# Altium schematic sheet BoardA-Connectors.SchDoc
size A; SheetNumber: 2; SheetTotal: 9
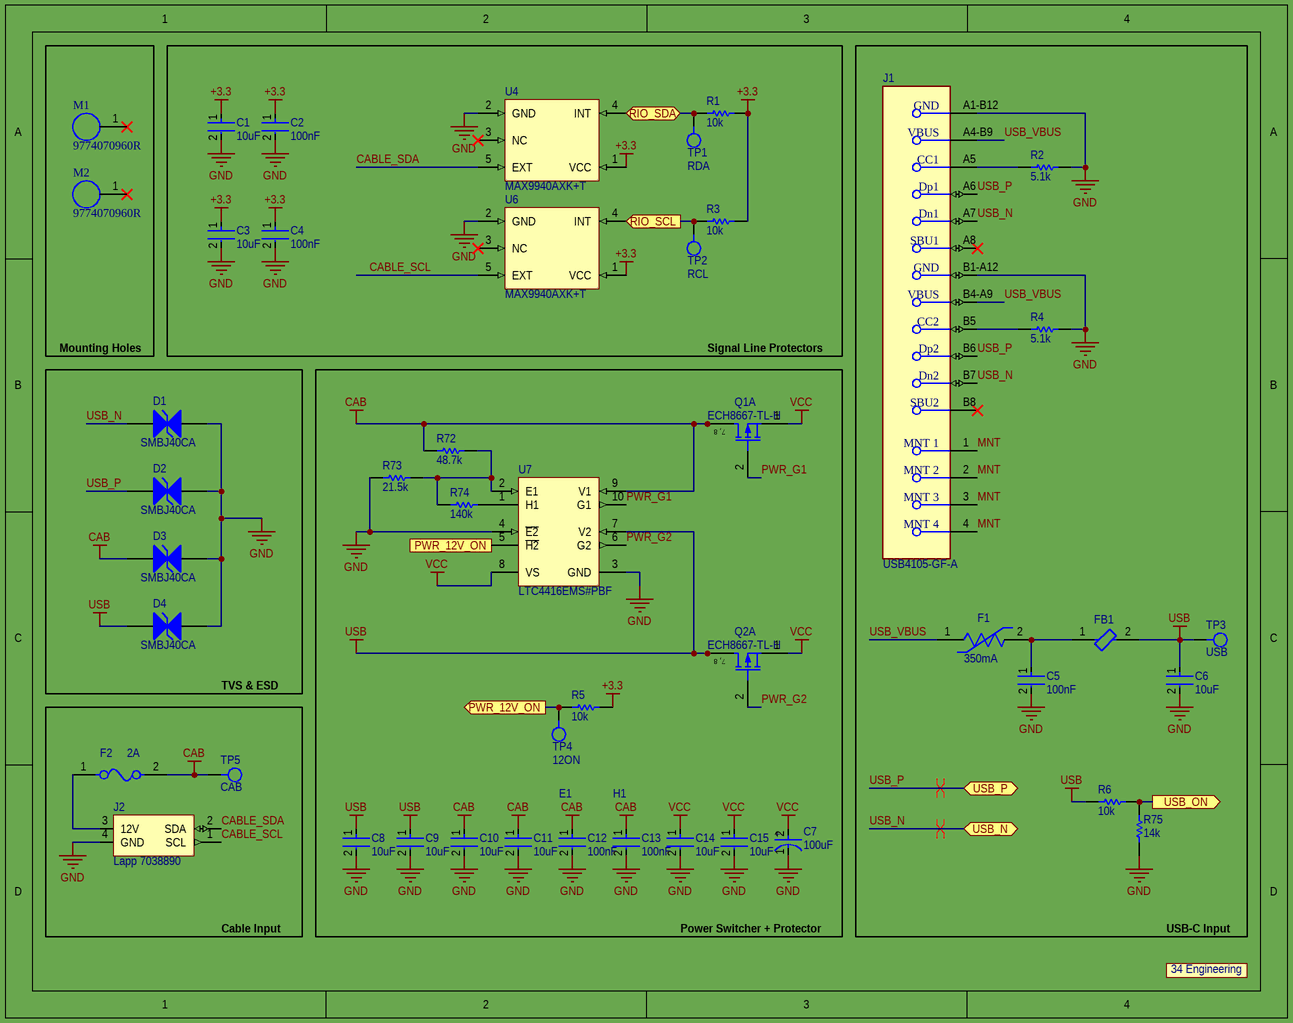
[diagram p0: BoardA-Connectors.SchDoc]

## Parts
C1  10uF  [FP-GRM188-0_1-e0_2_0_55-IPC_A]
C2  100nF  [FP-CGA3E-0_3-0_1-IPC_A]
C3  10uF  [FP-GRM188-0_1-e0_2_0_55-IPC_A]
C4  100nF  [FP-CGA3E-0_3-0_1-IPC_A]
C5  100nF  [FP-CGA3E-0_3-0_1-IPC_A]
C6  10uF  [FP-C3225-250-0_4-MFG]
C7  100uF  [FP-T491X107K025AT-MFG]
C8  10uF  [FP-C3225-250-0_4-MFG]
C9  10uF  [FP-C3225-250-0_4-MFG]
C10  10uF  [FP-C3225-250-0_4-MFG]
C11  10uF  [FP-C3225-250-0_4-MFG]
C12  100nF  [FP-CGA3E-0_3-0_1-IPC_A]
C13  100nF  [FP-CGA3E-0_3-0_1-IPC_A]
C14  10uF  [FP-C3225-250-0_4-MFG]
C15  10uF  [FP-C3225-250-0_4-MFG]
D1  SMBJ40CA  [FAIR-DO-214AA-A-2_V]
D2  SMBJ40CA  [FAIR-DO-214AA-A-2_V]
D3  SMBJ40CA  [FAIR-DO-214AA-A-2_V]
D4  SMBJ40CA  [FAIR-DO-214AA-A-2_V]
F1  350mA  [FP-1812L035-30DR-MFG]
F2  2A  [FP-2920L-MFG]
FB1  BLM15AG100SN1D  [FP-BLM15-0_05-IPC_A]  (value not drawn)
J1  USB4105-GF-A  [FP-USB4105-GF-A-MFG]
J2  Lapp 7038890  [Lapp 7038890]
LOGO0  34 Engineering Logo  [34EngineeringLogo]  (value not drawn)
M1  9774070960R  [9774070960R]
M2  9774070960R  [9774070960R]
Q1  ECH8667-TL-H  [ONSC-ECH-8_V]  (part A of 2)
Q2  ECH8667-TL-H  [ONSC-ECH-8_V]  (part A of 2)
R1  10k  [RESC1609X55X30LL15T15]
R2  5.1k  [RESC1608X55X30ML20T20]
R3  10k  [RESC1609X55X30LL15T15]
R4  5.1k  [RESC1608X55X30ML20T20]
R5  10k  [RESC1609X55X30LL15T15]
R6  10k  [RESC1609X55X30LL15T15]
R72  48.7k  [RESC1608X55X30ML15T15]
R73  21.5k  [RESC1608X55X30ML15T15]
R74  140k  [RESC1608X55X30LL15T15]
R75  14k  [RESC1608X55X30ML15T15]
TP1  RDA  [TestPoint1mm]
TP2  RCL  [TestPoint1mm]
TP3  USB  [TestPoint1mm]
TP4  12ON  [TestPoint1mm]
TP5  CAB  [TestPoint1mm]
U4  MAX9940AXK+T  [MAX9940AXK+T]
U6  MAX9940AXK+T  [MAX9940AXK+T]
U7  LTC4416EMS#PBF  [LT-MS-10_N]

## Blocks framed on the sheet
Mounting Holes: M1 M2
Signal Line Protectors: C1-C4 R1 R3 TP1 TP2 U4 U6
USB-C Input: C5 C6 F1 FB1 J1 R2 R4 R6 R75 TP3
TVS & ESD: D1-D4

## Ports
PWR_12V_ON (out), RIO_SCL (out), RIO_SDA (bidir), USB_N (bidir), USB_ON (out), USB_P (bidir)

## Nets
+3.3: C1.1 C2.1 C3.1 C4.1 R1.2 R3.2 R5.2 U4.1(VCC) U6.1(VCC)
CAB: C10.1 C11.1 C12.1 C13.1 D3.2(A) F2.2 Q1.7(D1) Q1.8(D1) R72.1 TP5.1 U7.9(V1)
GND: C1.2 C2.2 C3.2 C4.2 C5.2 C6.2 C7.1(C) C8.2 C9.2 C10.2 C11.2 C12.2 C13.2 C14.2 C15.2 D1.1(A) D2.1(A) D3.1(A) D4.1(A) J1.A1-B12(GND) J1.B1-A12(GND) J2.4(GND) R2.2 R4.2 R73.1 R75.1 U4.2(GND) U6.2(GND) U7.3(GND) U7.4(~{E2})
USB: C6.1 C8.1 C9.1 D4.2(A) FB1.2 Q2.7(D1) Q2.8(D1) R6.2 TP3.1 U7.7(V2)
VCC: C7.2(A) C14.1 C15.1 Q1.1(S1) Q2.1(S1) U7.8(VS)
CABLE_SCL: J2.1(SCL) U6.5(EXT)
CABLE_SDA: J2.2(SDA) U4.5(EXT)
MNT: J1.1(MNT_1) J1.2(MNT_2) J1.3(MNT_3) J1.4(MNT_4)
PWR_12V_ON: R5.1 TP4.1 U7.5(~{H2}) ; port PWR_12V_ON
PWR_G1: Q1.2(G1) U7.10(G1)
PWR_G2: Q2.2(G1) U7.6(G2)
RIO_SCL: R3.1 TP2.1 U6.4(INT) ; port RIO_SCL
RIO_SDA: R1.1 TP1.1 U4.4(INT) ; port RIO_SDA
USB_N: D1.2(A) J1.A7(Dn1) J1.B7(Dn2) ; port USB_N
USB_ON: R6.1 R75.2 ; port USB_ON
USB_P: D2.2(A) J1.A6(Dp1) J1.B6(Dp2) ; port USB_P
USB_VBUS: F1.1 J1.A4-B9(VBUS) J1.B4-A9(VBUS)
NetC5_1: C5.1 F1.2 FB1.1
NetF2_1: F2.1 J2.3(12V)
NetJ1_A5: J1.A5(CC1) R2.1
NetJ1_B5: J1.B5(CC2) R4.1
NetR72_2: R72.2 R73.2 R74.1 U7.2(E1)
NetR74_2: R74.2 U7.1(H1)

Not connected (* = marked no-connect by the designer): J1 A8(SBU1)* B8(SBU2)*; M1 1*; M2 1*; U4 3(NC)*; U6 3(NC)*

## Layout directives
differential pair; differential pair class USB: USB_N, USB_P

## Notes on the sheet
- E1
- H1
- Cable Input
- Power Switcher + Protector
- (in symbol 34EngineeringLogo) 34 Engineering
- (in symbol CMP-1058-00460-1, part A) 7, 8
- (in symbol CMP-2000-07204-2) +

## Library data of the parts
C1 C3 = CMP-2006-02792-2: Chip Multilayer Ceramic Capacitors for General Purpose, 0603, 10uF, X5R, 15%, 20%, 6.3V; Packaging: Tape and Reel; Voltage Rating (DC): 6.3V; Width: 0.031inch; Termination: SMD/SMT; Dielectric: X5R; Package Quantity: 4000; Voltage Rating: 6.3V; Capacitance: 10uF; Case/Package: 0603; Min Operating Temperature: -55°C; Voltage: 6.3V; Length: 1.6mm; Thickness: 0.035inch; Lead Free: Lead Free; Depth: 0.8mm; Case Code (Imperial): 0603; Max Operating Temperature: 85°C; Material: Ceramic; Height: 0.8mm; Tolerance: 20%; Mount: Surface Mount; REACH SVHC: No SVHC; Radiation Hardening: No; Case Code (Metric): 1608
C2 C4 C5 C12 C13 = CMP-2000-07546-2: Cap Ceramic 100nF 50V X7R 10% Pad SMD 0603 +125°C Automotive T/R; Weight: 7.1E-05oz; Composition: Ceramic; Max Operating Temperature: 125°C; Termination: SMD/SMT; Dielectric: X7R; Length: 1.6mm; Package Quantity: 1; REACH SVHC: No SVHC; Lead Free: Lead Free; Case Code (Metric): 1608; Min Operating Temperature: -55°C; Packaging: Tape and Reel; Tolerance: 10%; Voltage Rating: 50V; Case Code (Imperial): 0603; Capacitance: 100nF; Case/Package: 0603; Voltage Rating (DC): 50V; Depth: 0.8mm; Radiation Hardening: No; Ratings: AEC-Q200; Mount: Surface Mount; Voltage: 50V; Thickness: 0.035inch; Width: 0.8mm; Height: 0.8mm
C6 C8-C11 C14 C15 = CMP-08246-002653-1: Multilayer Ceramic Capacitors 10uF ±20% 50V X7R SMD 1210; Width: 0.098inch; Package Quantity: 1000; Height: 2.5mm; Dielectric Material: Ceramic; Voltage Rating: 50V; Series: C; Capacitance: 10uF; Tolerance: 20%; Weight: 0.000564oz; Case/Package: 1210; Case Code (Imperial): 1210; Dielectric: X7R; Case Code (Metric): 3225; REACH SVHC: No SVHC; Packaging: Tape and Reel; Length: 0.126inch; Termination: SMD/SMT; Min Operating Temperature: -55°C; Voltage Rating (DC): 50V; Lead Free: Lead Free; Max Operating Temperature: 125°C; Thickness: 0.11inch; Mount: Surface Mount
C7 = CMP-2000-07204-2: CAP TANT 100UF 10% 25V 2917; Leakage Current: 25uA; Ripple Current: 742mA; Polarity: Polar; Dissipation Factor: 8%; Life (Hours): 2000Hour; Dielectric Material: Tantalum; ESR (Equivalent Series Resistance): 300mR; Length: 7.3mm; RoHS Compliant: No; Failure Rate: 0.001%; REACH SVHC: No SVHC; Tolerance: 10%; Mount: Surface Mount; Height - Seated (Max): 0.169inch; Features: General Purpose; Height: 4mm; Package Quantity: 1; Case Code (Metric): 7343; Max Operating Temperature: 125°C; Number of Pins: 2; Radiation Hardening: No; Lead Free: Lead Free; Capacitance: 100uF; Termination: SMD/SMT; Voltage Rating: 25V; Series: T491; Depth: 4.3mm; Construction: Flat; Case/Package: 2917; Min Operating Temperature: -55°C; Voltage Rating (DC): 25V; Width: 4.3mm; Packaging: Tape and Reel; Case Code (Imperial): 2917; Voltage: 25V
D1-D4 = CMP-2000-07097-1: Transient Voltage Suppressor, 600 W, 40 V, -55 to 150 degC, 2-Pin SMD, RoHS, Tape and Reel; Manufacturer: Fairchild Semiconductor; Breakdown Voltage-Max: 49.1V; Power Dissipation: 600W; Directional: Bi-Directional; Clamping Voltage-Max: 64.5V; Breakdown Voltage-Min: 44.4V; Datasheet URL: https://www.fairchildsemi.com/datasheets/SM/SMBJ40CA.pdf; Package Description: 2-Pin Surface Mount Device, Body 4.4 x 3.625 mm; Package Reference: DO-214AA; Manufacturer URL: https://www.fairchildsemi.com/; Mounting Technology: SurfaceMount; Datasheet Version: Rev. 1.1.1, 11/2014
F1 = CMP-08606-000005-1: PTC RESET FUSE 30V 350MA 1812; Manufacturer Part Number: 1812L035/30DR; Manufacturer: Littelfuse Inc; Trip Time: 0.15s; Hold Current: 0.35A; Value: 0.4-1.7Ω; Trip Current: 0.75A; Current Rating: 40A; Temperature Range High: +85°C; Ambient Temperature Range High: +85°C; Device Class L2: PTC Resettable Fuses; RoHS: TRUE; Digikey Description: PTC RESET FUSE 30V 350MA 1812; ComponentLink2URL: https://www.littelfuse.com/~/media/electronics/datasheets/resettable_ptcs/littelfuse_ptc_1812l_datasheet.pdf.pdf; Lead Free: Yes; Ambient Temperature Range Low: -40°C; Automotive: No; Category: Fuse; Octopart: https://octopart.com/1812l035%2F30dr-littelfuse-19645438; Device Class L3: unset; Device Class L1: Circuit Protection; Temperature Range Low: -40°C; Mouser Description: Resettable Fuses - PPTC PTC 30V POLY 1812 HALOGEN-FREE .35A; Package: 0; Voltage Rating: 30V; ComponentLink2Description: Datasheet; Temperature: -40°C to +85°C; Resistance: 0.4-1.7Ω; Height: 1.25mm
F2 = CMP-08606-000027-1: PTC RESET FUSE 24V 2A 2920; Manufacturer Part Number: 2920L200/24DR; Manufacturer: Littelfuse Inc; Current Rating: 40A; Resistance: 0.05-0.125Ω; Trip Current: 4A; Value: 0.05-0.125Ω; Trip Time: 5s; Hold Current: 2A; Device Class L2: PTC Resettable Fuses; Package: 2920L; Octopart: https://octopart.com/2920l200%2F24dr-littelfuse-673793; Category: Fuse; Device Class L1: Circuit Protection; Temperature Range High: +85°C; Device Class L3: unset; Mouser Description: Resettable Fuses - PPTC 24V 2920 2A POLYFUSE; Temperature Range Low: -40°C; ComponentLink2URL: https://www.littelfuse.com/~/media/electronics/datasheets/resettable_ptcs/littelfuse_ptc_2920l_datasheet.pdf.pdf; Voltage Rating: 24V; Automotive: No; Ambient Temperature Range Low: -40°C; Height: 1.25mm; Digikey Description: PTC RESET FUSE 24V 2A 2920; Temperature: -40°C to +85°C; Lead Free: Yes; Ambient Temperature Range High: +85°C; RoHS: TRUE; ComponentLink2Description: Datasheet
FB1 = CMP-0686-00176-4: Chip Ferrite Bead, 0402, 10Ω @ 100MHz, 0.025Ω, 25%, 1A; Number of Circuits: 1; DC Resistance (DCR): 25mR; Shielding: Unshielded; Resistance: 50mR; Impedance: 10R; Max Current Rating: 1A; Length: 1mm; Min Operating Temperature: -55°C; Case Code (Imperial): 0402; Current Rating: 1A; Termination: SMD/SMT; Test Frequency: 100MHz; Depth: 0.55mm; Package Quantity: 1; Packaging: Tape and Reel; Height: 0.5mm; Max DC Current: 1A; DC Current: 1A; RoHS Compliant: Yes; Resistor Type: Ferrite Bead; Tolerance: 25%; Number of Lines: 1; Lead Free: Lead Free; Max Operating Temperature: 125°C; Core Material: Ferrite; Case Code (Metric): 1005; REACH SVHC: No SVHC; Width: 0.5mm; Radiation Hardening: No; Number of Pins: 2; Material: Ferrite; Case/Package: 0402; Military Standard: Not; Weight: 2.3E-05oz
J1 = CMP-245163-000001-1: CONN RCPT USB2.0 TYPEC 5A; Manufacturer: GCT; Voltage Rating: 20V; Is Female: yes; Current Rating: 5/6.25/1.25/0.25A; Number Of Contacts: 16; Conn Orientation: Right Angle; Device Class L1: Connectors; Category: Conn; Lead Free: Yes; RoHS: TRUE; Temperature Range High: +85°C; Digikey Description: CONN RCPT USB2.0 TYPEC 5A; Device Class L3: unset; ComponentLink2Description: Datasheet; Manufacturer Part Number: USB4105-GF-A; Package: 0; Usb Standard: USB 2.0; Device Class L2: USB Connectors; Automotive: No; Temperature Range Low: -40°C; Height: 3.46mm; Temperature: -40°C to +85°C; Contact Material: Gold,Nickel; ComponentLink2URL: https://gct.co/files/drawings/usb4105.pdf; Octopart: https://octopart.com/usb4105-gf-a-gct-106627878
LOGO0 = 34EngineeringLogo: 34 Engineering Silkscreen Logo
M1 M2 = 9774070960R: WURTH ELEKTRONIK - 9774070960R - Abstandhalter, SMD, Stahl, rund, Durchgangsloch, 6mm x 7mm, 3.3mm Innen-Ø, Produktreihe WA-SMST; Manufacturer: Wurth Electronics; Plating: Tin; Threaded/Unthreaded: Unthreaded; Inside Diameter: 0.13inch; Outside Diameter: 0.236inch; Supplier 1: Digi-Key; Manufacturer Part Number: 9774070960R; RoHS: Yes; Category: Spacers, Standoffs; Stock 1: 8951; Pricing 1: 1=1.73000, 10=1.65800, 50=1.45600, 100=1.35500 (USD); Material: Steel; Length: 0.33inch; REACH SVHC: Unknown; ComponentLink1URL: http://www.mouser.com/ds/2/445/9774070960R-611130.pdf?src-supplier=Mouser; ComponentLink1Description: http://www.mouser.com/ds/2/445/9774070960R-611130.pdf?src-supplier=Mouser; ComponentLink2URL: http://www.farnell.com/datasheets/1960400.pdf?src-supplier=Farnell; ComponentLink2Description: http://www.farnell.com/datasheets/1960400.pdf?src-supplier=Farnell; ComponentLink3URL: https://media.digikey.com/pdf/Data%20Sheets/Wurth%20Electronics%20PDFs/WA-SMSx_Performance_Flyer.pdf?src-supplier=Digi-Key; ComponentLink3Description: https://media.digikey.com/pdf/Data%20Sheets/Wurth%20Electronics%20PDFs/WA-SMSx_Performance_Flyer.pdf?src-supplier=Digi-Key; ComponentLink4URL: http://www.farnell.com/datasheets/1960400.pdf?src-supplier=Newark; ComponentLink4Description: http://www.farnell.com/datasheets/1960400.pdf?src-supplier=Newark; ComponentLink5URL: http://www.farnell.com/datasheets/1960400.pdf?src-supplier=Element14; ComponentLink5Description: http://www.farnell.com/datasheets/1960400.pdf?src-supplier=Element14; Supplier Part Number 1: 732-7109-1-ND
Q1 Q2 = CMP-1058-00460-1: P-Channel Power MOSFET, -30 V, -5.5 A, 39 mOhm, Dual, 8-Pin ECH, Pb-Free, Tape and Reel; Manufacturer: On Semiconductor; PD Max (W): 1.3; Coss Typ (pF): 145; Channel Polarity: P Channel; VGS Max (V): 20; ID Max (A): 5.5; VGS(th) Max (V): 2.6; Ciss Typ (pF): 600; V(BR)DSS Min (V): 30; Crss Typ (pF): 110; ComponentLink3URL: http://www.onsemi.com/pub_link/Collateral/ECH8308-D.PDF; RoHS: Pb-Free; ComponentLink2Description: Datasheet; ComponentLink1Description: Manufacturer URL; Mounting Technology: Surface Mount; Configuration: Dual; Packing: Tape and Reel; ComponentLink1URL: http://www.onsemi.com/; ComponentLink2URL: http://www.onsemi.com/pub_link/Collateral/ECH8667-D.PDF; PackageDescription: 8-Pin SOT23, Body 2.9 x 2.3 mm, Pitch 0.65 mm; PartNumber: ECH8667-TL-H; ComponentLink3Description: Package Specification; PackageReference: ECH-8; Package Type: SOT-28 FL / ECH-8
R1 R3 R5 R6 = CMP-1012-00623-3: Chip Resistor, 10 KOhm, +/- 1%, 0.1 W, -55 to 155 degC, 0603 (1608 Metric), RoHS, Tape and Reel; Manufacturer: Panasonic; Voltage Rating: 75V; Case\/Package: 0603; Power Rating: 100mW; Resistance: 10KOhm; Temperature Coefficient: 100ppm\/degreesC; Number of Pins: 2; Package Reference: 603; Depth: 0.8mm; Mount: SurfaceMount; Package Description: 2-Pin Surface Mount Device, Body 1.6 x 0.85 mm; Datasheet Version: 02/2017; Length: 1.6mm; Lead Free: LeadFree; Height: 0.45mm; Number of Terminations: 2; Max Power Dissipation: 100mW; Min Operating Temperature: -55degC; Datasheet URL: https://industrial.panasonic.com/cdbs/www-data/pdf/RDA0000/AOA0000C304.pdf; Termination: SMD/SMT; Case Code (Metric): 1608; Case Code (Imperial): 0603; Tolerance: 1%; Max Operating Temperature: 155degC; RoHSCompliant: true; Voltage Rating (DC): 75V; Radiation Hardening: No; Packaging: TapeandReel; Composition: ThickFilm; Mounting Technology: SurfaceMount; Manufacturer URL: http://www.panasonic.com/; Width: 0.031inch; REACH SVHC: NoSVHC; Contact Plating: Tin; Military Standard: Not; Package Quantity: 1
R2 R4 = CMP-2000-00085-1: Manufacturer: Panasonic; Part Number: ERA3AEB512V
R72 = CMP-1012-00701-2: Manufacturer: Panasonic; Part Number: ERJ-3EKF4872V
R73 = CMP-2000-00332-1: Part Number: ERJ-3EKF2152V; Manufacturer: Panasonic
R74 = CMP-2000-00248-1: Manufacturer: Panasonic; Part Number: ERJ-3EKF1403V
R75 = CMP-2000-00247-1: Part Number: ERJ-3EKF1402V; Manufacturer: Panasonic
TP1-TP5 = TestPoint1mm: Test Point 1mm Diameter
U7 = CMP-0479-00144-1: Low Loss Dual PowerPath Controller for Large PFET, 3.6 to 36 V Vin, 10-pin SOP (MS-10), -40 to 85 degC, Pb-Free; Manufacturer: Linear Technology; Ideal Diode: Dual, External, P-Channel; ComponentLink2Description: Datasheet; ComponentLink1URL: http://www.linear.com/; ComponentLink2URL: http://cds.linear.com/docs/en/datasheet/4416fa.pdf; ComponentLink3Description: Package Specification; PackageReference: MS-10; RoHS: TRUE; PackageDescription: 10-Pin Plastic MSOP, Body 3 x 3 mm, Pitch 0.5 mm; ComponentLink3URL: http://cds.linear.com/docs/en/packaging/05081661_F_MS.pdf; PackageVersion: Rev. E, 06/2010; PartNumber: LTC4416EMS#PBF; ComponentLink1Description: Manufacturer URL; DatasheetVersion: Rev. A; Mounting Technology: Surface Mount